# Altium schematic sheet sine-waveGenerator.SchDoc
size A4
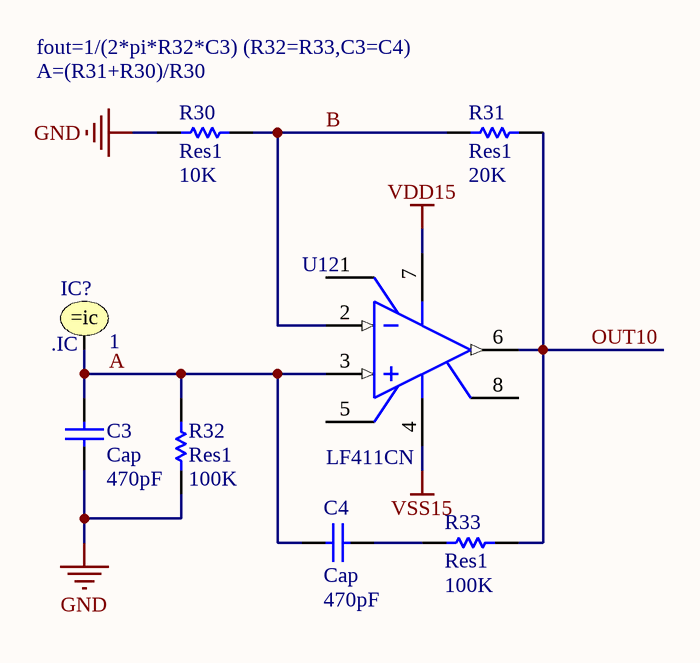
[diagram p0: sine-waveGenerator.SchDoc]

## Parts
C3  Cap  value 470pF  [RAD-0.3]
C4  Cap  value 470pF  [RAD-0.3]
IC?  .IC  Initial Voltage: 1
R30  Res1  value 10K  [AXIAL-0.3]
R31  Res1  value 20K  [AXIAL-0.3]
R32  Res1  value 100K  [AXIAL-0.3]
R33  Res1  value 100K  [AXIAL-0.3]
U12  LF411CN  [N08E]

## Nets
GND: C3.1 R30.2 R32.2
VDD15: U12.7(V+)
VSS15: U12.4(V-)
A: C3.2 C4.1 IC?.1 R32.1 U12.3(IN+)
B: R30.1 R31.2 U12.2(IN-)
OUT10: R31.1 R33.1 U12.6(OUT)
NetC4_2: C4.2 R33.2

Not connected (* = marked no-connect by the designer): U12 1(BAL) 5(BAL) 8(NC)

## Notes on the sheet
- fout=1/(2*pi*R32*C3) (R32=R33,C3=C4)
- (near R30) A=(R31+R30)/R30

## Library data of the parts
C3 C4 = Cap: Capacitor; Published: 8-Jun-2000; LatestRevisionDate: 17-Jul-2002; LatestRevisionNote: Re-released for DXP Platform.; PackageReference: RAD-0.3; Publisher: Altium Limited; PackageDescription: Radial Cap, Thru-Hole; 2 Leads; 0.3 in Pin Spacing
IC? = .IC: Initial Condition; Published: 8-Jun-2000; LatestRevisionDate: 17-Jul-2002; LatestRevisionNote: Re-released for DXP Platform.; PackageReference: Not Applicable; Publisher: Altium Limited
R30-R33 = Res1: Resistor; Published: 8-Jun-2000; LatestRevisionDate: 17-Jul-2002; LatestRevisionNote: Re-released for DXP Platform.; PackageReference: AXIAL-0.3; Publisher: Altium Limited; PackageDescription: Axial Device, Thru-Hole; 2 Leads; 0.3 in Pin Spacing
U12 = LF411CN: Low Offset, Low Drift JFET Input Operational Amplifier, 8-pin MDIP; Manufacturer: National Semiconductor; PackageTopMarking: NSUZXYTTE#*LF*411CN; PowerWise: N; CompType: Amplifiers; Published: 4-Dec-2008; LatestRevisionDate: 13-Jan-2009; LatestRevisionNote: Sim Model Added.; DatasheetVersion: Aug-2000; PackageVersion: revG, May-2006; PackageReference: N08E; Publisher: Altium Limited; PackageDescription: MDIP, .365 x .250 x .130in, 8 Lead, .100in Pitch; Supplier 1: Farnell; Supplier Part Number 1: 9487026; PartNumber: LF411CN; RoHS: N; PinCount: 8; Code_JEDEC: MS-001-BA; ComponentLink1Description: LF411 Datasheet; ComponentLink1URL: http://www.national.com/ds/LF/LF411.pdf; ComponentLink2Description: LF411 Web Page; ComponentLink2URL: http://www.national.com/pf/LF/LF411.html; ComponentLink3Description: N08E Package Page; ComponentLink3URL: http://www.national.com/packaging/folders/n08e.html